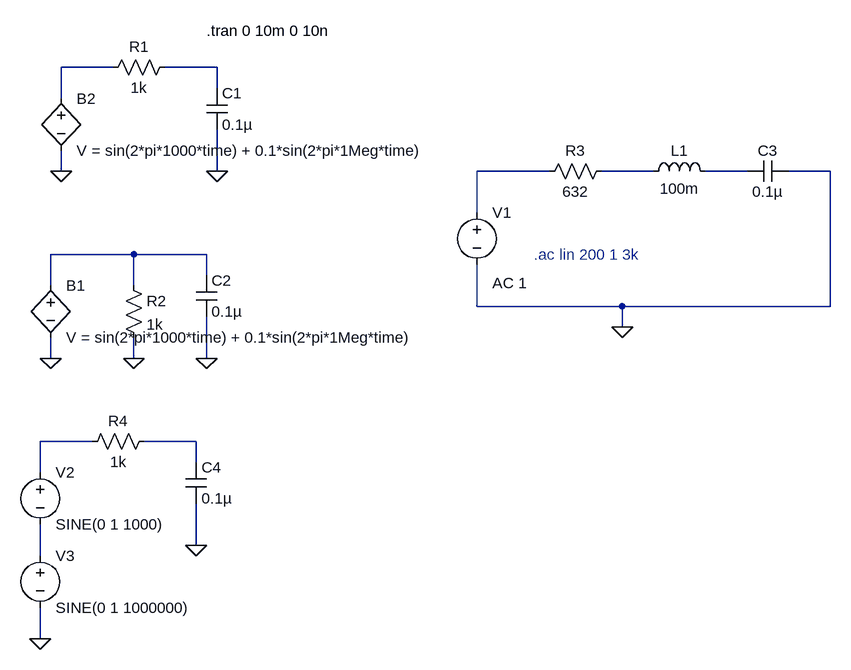
[diagram p0: schematic Circuitos-Serie-Paralelo.asc]
Circuitos-Serie-Paralelo.asc, the LTspice schematic file:
Version 4.1
SHEET 1 1252 1028
WIRE 144 112 64 112
WIRE 304 112 224 112
WIRE 304 144 304 112
WIRE 64 160 64 112
WIRE 64 272 64 240
WIRE 304 272 304 208
WIRE 816 272 704 272
WIRE 976 272 896 272
WIRE 1120 272 1056 272
WIRE 1248 272 1184 272
WIRE 704 336 704 272
WIRE 176 400 48 400
WIRE 288 400 176 400
WIRE 288 432 288 400
WIRE 48 448 48 400
WIRE 176 448 176 400
WIRE 704 480 704 416
WIRE 928 480 704 480
WIRE 1248 480 1248 272
WIRE 1248 480 928 480
WIRE 928 512 928 480
WIRE 48 560 48 528
WIRE 176 560 176 528
WIRE 288 560 288 496
WIRE 112 688 32 688
WIRE 272 688 192 688
WIRE 272 720 272 688
WIRE 32 736 32 688
WIRE 272 848 272 784
WIRE 32 864 32 816
WIRE 32 992 32 944
FLAG 304 272 0
FLAG 64 272 0
FLAG 288 560 0
FLAG 48 560 0
FLAG 176 560 0
FLAG 928 512 0
FLAG 272 848 0
FLAG 32 992 0
DATAFLAG 768 272 ""
DATAFLAG 1216 272 ""
DATAFLAG 928 272 ""
DATAFLAG 960 272 ""
SYMBOL res 240 96 R90
WINDOW 0 0 56 VBottom 2
WINDOW 3 32 56 VTop 2
SYMATTR InstName R1
SYMATTR Value 1k
SYMBOL bv 64 144 R0
SYMATTR InstName B2
SYMATTR Value V = sin(2*pi*1000*time) + 0.1*sin(2*pi*1Meg*time)
SYMBOL cap 288 144 R0
SYMATTR InstName C1
SYMATTR Value 0.1µ
SYMBOL bv 48 432 R0
SYMATTR InstName B1
SYMATTR Value V = sin(2*pi*1000*time) + 0.1*sin(2*pi*1Meg*time)
SYMBOL cap 272 432 R0
SYMATTR InstName C2
SYMATTR Value 0.1µ
SYMBOL res 160 432 R0
SYMATTR InstName R2
SYMATTR Value 1k
SYMBOL res 912 256 R90
WINDOW 0 0 56 VBottom 2
WINDOW 3 32 56 VTop 2
SYMATTR InstName R3
SYMATTR Value 632
SYMBOL ind 960 288 R270
WINDOW 0 32 56 VTop 2
WINDOW 3 5 56 VBottom 2
SYMATTR InstName L1
SYMATTR Value 100m
SYMBOL cap 1184 256 R90
WINDOW 0 0 32 VBottom 2
WINDOW 3 32 32 VTop 2
SYMATTR InstName C3
SYMATTR Value 0.1µ
SYMBOL res 208 672 R90
WINDOW 0 0 56 VBottom 2
WINDOW 3 32 56 VTop 2
SYMATTR InstName R4
SYMATTR Value 1k
SYMBOL cap 256 720 R0
SYMATTR InstName C4
SYMATTR Value 0.1µ
SYMBOL voltage 32 720 R0
WINDOW 123 0 0 Left 0
WINDOW 39 0 0 Left 0
SYMATTR InstName V2
SYMATTR Value SINE(0 1 1000)
SYMBOL voltage 32 848 R0
WINDOW 123 0 0 Left 0
WINDOW 39 0 0 Left 0
SYMATTR InstName V3
SYMATTR Value SINE(0 1 1000000)
SYMBOL voltage 704 320 R0
WINDOW 123 24 124 Left 2
WINDOW 39 0 0 Left 0
SYMATTR Value2 AC 1
SYMATTR InstName V1
SYMATTR Value ""
TEXT 288 56 Left 2 !.tran 0 10m 0 10n
TEXT 792 400 Left 2 ;.ac lin 200 1 3k

The netlist it stands for:
* Circuitos-Serie-Paralelo.asc
R1 N002 N001 1k
B2 N001 0 V = sin(2*pi*1000*time) + 0.1*sin(2*pi*1Meg*time)
C1 N002 0 0.1µ
B1 N006 0 V = sin(2*pi*1000*time) + 0.1*sin(2*pi*1Meg*time)
C2 N006 0 0.1µ
R2 N006 0 1k
R3 N004 N003 632
L1 N004 N005 100m
C3 0 N005 0.1µ
R4 N008 N007 1k
C4 N008 0 0.1µ
V2 N007 N009 SINE(0 1 1000)
V3 N009 0 SINE(0 1 1000000)
V1 N003 0 AC 1
.tran 0 10m 0 10n
* .ac lin 200 1 3k
.backanno
.end